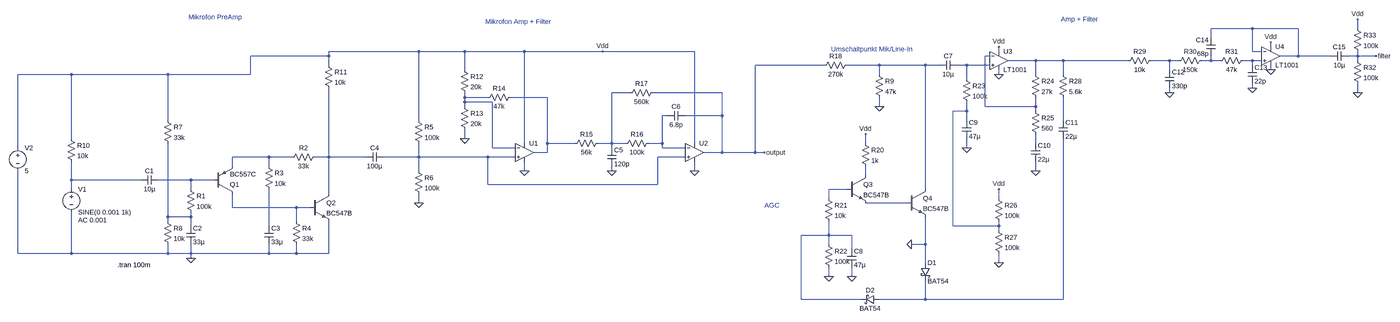
[diagram p0: schematic mikrofon input 2.asc, whole sheet]
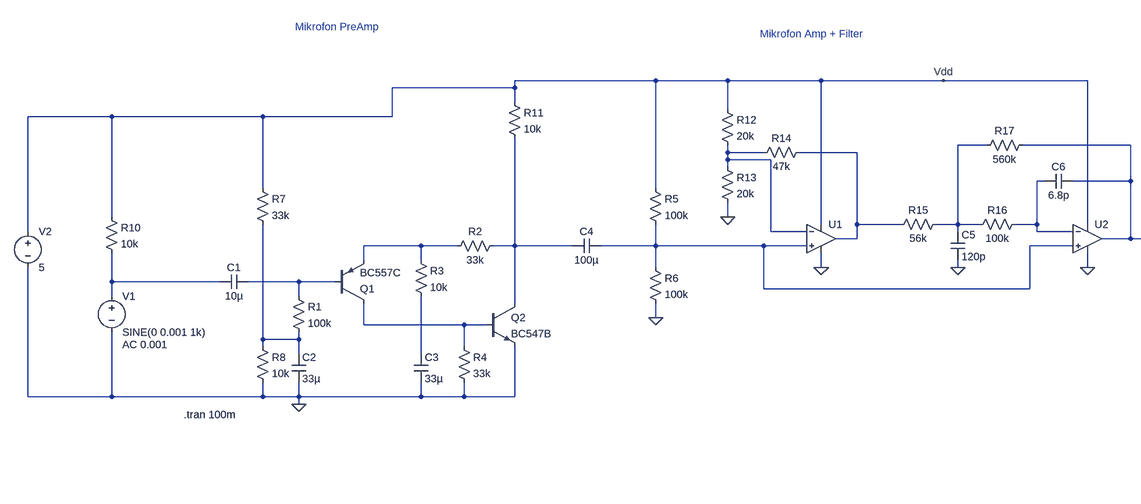
[diagram p1: schematic mikrofon input 2.asc, part, row 1 of 1, column 1 of 2]
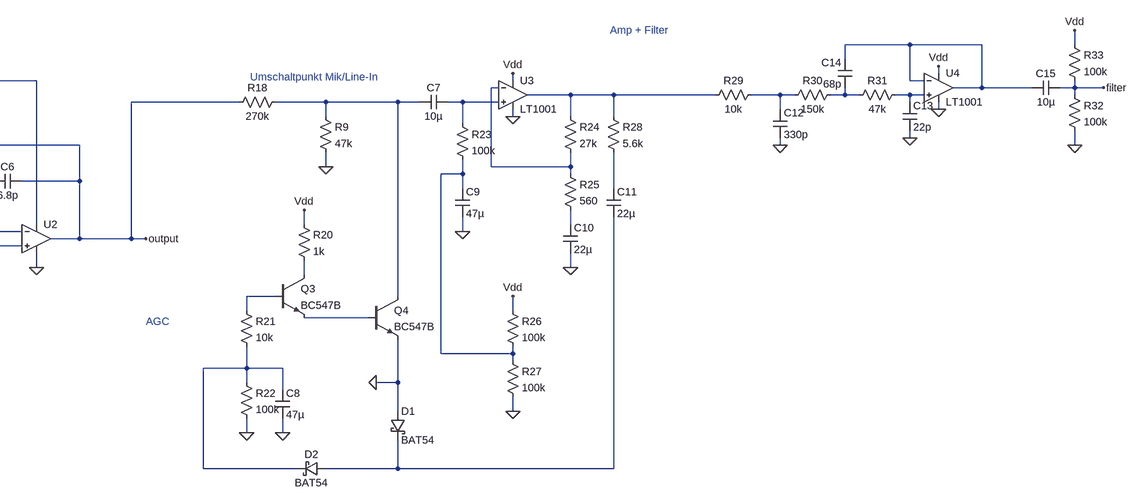
[diagram p2: schematic mikrofon input 2.asc, part, row 1 of 1, column 2 of 2]
mikrofon input 2.asc, the LTspice schematic file:
Version 4
SHEET 1 4684 680
WIRE 4144 -464 4000 -464
WIRE 4304 -464 4144 -464
WIRE 4544 -464 4544 -496
WIRE 4000 -432 4000 -464
WIRE 4208 -400 4208 -416
WIRE 1024 -384 704 -384
WIRE 1184 -384 1024 -384
WIRE 1392 -384 1184 -384
WIRE 1664 -384 1392 -384
WIRE 1984 -384 1664 -384
WIRE 3120 -384 3120 -400
WIRE 4144 -384 4144 -464
WIRE 4176 -384 4144 -384
WIRE 704 -368 704 -384
WIRE 704 -368 432 -368
WIRE 3088 -368 3072 -368
WIRE 4304 -368 4304 -464
WIRE 4304 -368 4240 -368
WIRE 4448 -368 4304 -368
WIRE 4544 -368 4544 -384
WIRE 4544 -368 4512 -368
WIRE 4608 -368 4544 -368
WIRE 3248 -352 3152 -352
WIRE 3344 -352 3248 -352
WIRE 3712 -352 3344 -352
WIRE 3856 -352 3792 -352
WIRE 3888 -352 3856 -352
WIRE 4000 -352 4000 -368
WIRE 4000 -352 3968 -352
WIRE 4032 -352 4000 -352
WIRE 4144 -352 4112 -352
WIRE 4176 -352 4144 -352
WIRE 4544 -352 4544 -368
WIRE 704 -336 704 -368
WIRE 2512 -336 2272 -336
WIRE 2704 -336 2592 -336
WIRE 2864 -336 2704 -336
WIRE 2912 -336 2864 -336
WIRE 3008 -336 2976 -336
WIRE 3088 -336 3008 -336
WIRE 4144 -336 4144 -352
WIRE 1184 -320 1184 -384
WIRE 3856 -320 3856 -352
WIRE 4208 -320 4208 -336
WIRE -192 -304 -400 -304
WIRE 144 -304 -192 -304
WIRE 432 -304 432 -368
WIRE 432 -304 144 -304
WIRE 2704 -304 2704 -336
WIRE 3120 -304 3120 -320
WIRE 3248 -304 3248 -352
WIRE 3344 -304 3344 -352
WIRE 3008 -288 3008 -336
WIRE 4144 -256 4144 -272
WIRE 1760 -240 1696 -240
WIRE 2080 -240 1840 -240
WIRE 3856 -240 3856 -256
WIRE 4544 -240 4544 -272
WIRE 1184 -224 1184 -240
WIRE 1264 -224 1184 -224
WIRE 1472 -224 1344 -224
WIRE 1184 -208 1184 -224
WIRE 1280 -208 1184 -208
WIRE 1184 -192 1184 -208
WIRE 2704 -192 2704 -224
WIRE 3072 -192 3072 -368
WIRE 3248 -192 3248 -224
WIRE 3248 -192 3072 -192
WIRE 3008 -176 3008 -208
WIRE 3008 -176 2960 -176
WIRE 3248 -176 3248 -192
WIRE 1888 -160 1872 -160
WIRE 2080 -160 2080 -240
WIRE 2080 -160 1952 -160
WIRE 144 -144 144 -304
WIRE 1024 -144 1024 -384
WIRE 3008 -144 3008 -176
WIRE 3344 -144 3344 -224
WIRE -192 -80 -192 -304
WIRE 1184 -80 1184 -112
WIRE 1392 -64 1392 -384
WIRE 1472 -64 1472 -224
WIRE 1568 -64 1472 -64
WIRE 1696 -64 1696 -240
WIRE 1696 -64 1648 -64
WIRE 1744 -64 1696 -64
WIRE 1872 -64 1872 -160
WIRE 1872 -64 1824 -64
WIRE 1984 -64 1984 -384
WIRE 2656 -64 2656 -96
WIRE 3248 -64 3248 -96
WIRE -400 -48 -400 -304
WIRE 1280 -48 1280 -208
WIRE 1360 -48 1280 -48
WIRE 1696 -48 1696 -64
WIRE 1872 -48 1872 -64
WIRE 1952 -48 1872 -48
WIRE 3008 -48 3008 -80
WIRE 1472 -32 1472 -64
WIRE 1472 -32 1424 -32
WIRE 2080 -32 2080 -160
WIRE 2080 -32 2016 -32
WIRE 2272 -32 2272 -336
WIRE 2272 -32 2080 -32
WIRE 2304 -32 2272 -32
WIRE 496 -16 368 -16
WIRE 576 -16 496 -16
WIRE 704 -16 704 -256
WIRE 704 -16 656 -16
WIRE 832 -16 704 -16
WIRE 1024 -16 1024 -64
WIRE 1024 -16 896 -16
WIRE 1264 -16 1024 -16
WIRE 1360 -16 1264 -16
WIRE 1952 -16 1856 -16
WIRE 368 16 368 -16
WIRE 496 16 496 -16
WIRE 1024 32 1024 -16
WIRE 1392 32 1392 0
WIRE 1696 32 1696 16
WIRE 1984 32 1984 0
WIRE 3248 32 3248 0
WIRE 2656 48 2656 16
WIRE -192 64 -192 0
WIRE 48 64 -192 64
WIRE 224 64 112 64
WIRE 304 64 224 64
WIRE 1264 80 1264 -16
WIRE 1856 80 1856 -16
WIRE 1856 80 1264 80
WIRE -192 96 -192 64
WIRE 224 96 224 64
WIRE 2592 96 2528 96
WIRE 2864 96 2864 -336
WIRE 704 112 704 -16
WIRE 2528 128 2528 96
WIRE 3120 128 3120 96
WIRE 1024 144 1024 112
WIRE 2800 144 2656 144
WIRE 368 160 368 112
WIRE 592 160 368 160
WIRE 640 160 592 160
WIRE 144 192 144 -64
WIRE 224 192 224 176
WIRE 224 192 144 192
WIRE 144 208 144 192
WIRE 592 208 592 160
WIRE 224 224 224 192
WIRE 496 224 496 96
WIRE 2960 224 2960 -176
WIRE 3120 224 3120 208
WIRE 3120 224 2960 224
WIRE 3120 240 3120 224
WIRE 2528 256 2528 208
WIRE 2528 256 2432 256
WIRE 2608 256 2528 256
WIRE 2528 288 2528 256
WIRE 2864 288 2864 192
WIRE 2864 288 2816 288
WIRE 2608 304 2608 256
WIRE -400 320 -400 32
WIRE -192 320 -192 176
WIRE -192 320 -400 320
WIRE 144 320 144 288
WIRE 144 320 -192 320
WIRE 224 320 224 288
WIRE 224 320 144 320
WIRE 496 320 496 288
WIRE 496 320 224 320
WIRE 592 320 592 288
WIRE 592 320 496 320
WIRE 704 320 704 208
WIRE 704 320 592 320
WIRE 224 336 224 320
WIRE 2864 352 2864 288
WIRE 3120 352 3120 320
WIRE 2528 400 2528 368
WIRE 2608 400 2608 368
WIRE 2432 480 2432 256
WIRE 2640 480 2432 480
WIRE 2864 480 2864 416
WIRE 2864 480 2704 480
WIRE 3344 480 3344 -80
WIRE 3344 480 2864 480
FLAG 224 336 0
FLAG 1392 32 0
FLAG 1984 32 0
FLAG 1024 144 0
FLAG 1184 -80 0
FLAG 1696 32 0
FLAG 2304 -32 output
FLAG 2656 -96 Vdd
FLAG 2528 400 0
FLAG 2608 400 0
FLAG 2816 288 0
FLAG 3120 -304 0
FLAG 3120 -400 Vdd
FLAG 3008 -48 0
FLAG 3248 32 0
FLAG 3120 96 Vdd
FLAG 3120 352 0
FLAG 3856 -240 0
FLAG 4208 -320 0
FLAG 4144 -256 0
FLAG 4208 -416 Vdd
FLAG 4544 -496 Vdd
FLAG 4544 -240 0
FLAG 4608 -368 filter
FLAG 1664 -384 Vdd
FLAG 2704 -192 0
SYMBOL voltage -192 80 R0
WINDOW 123 24 124 Left 2
WINDOW 39 0 0 Left 2
SYMATTR Value2 AC 0.001
SYMATTR InstName V1
SYMATTR Value SINE(0 0.001 1k)
SYMBOL cap 112 48 R90
WINDOW 0 0 32 VBottom 2
WINDOW 3 32 32 VTop 2
SYMATTR InstName C1
SYMATTR Value 10µ
SYMBOL res 208 80 R0
SYMATTR InstName R1
SYMATTR Value 100k
SYMBOL cap 208 224 R0
SYMATTR InstName C2
SYMATTR Value 33µ
SYMBOL pnp 304 112 M180
SYMATTR InstName Q1
SYMATTR Value BC557C
SYMBOL res 672 -32 R90
WINDOW 0 0 56 VBottom 2
WINDOW 3 32 56 VTop 2
SYMATTR InstName R2
SYMATTR Value 33k
SYMBOL cap 480 224 R0
SYMATTR InstName C3
SYMATTR Value 33µ
SYMBOL res 480 0 R0
SYMATTR InstName R3
SYMATTR Value 10k
SYMBOL npn 640 112 R0
SYMATTR InstName Q2
SYMATTR Value BC547B
SYMBOL res 576 192 R0
SYMATTR InstName R4
SYMATTR Value 33k
SYMBOL cap 896 -32 R90
WINDOW 0 0 32 VBottom 2
WINDOW 3 32 32 VTop 2
SYMATTR InstName C4
SYMATTR Value 100µ
SYMBOL res 128 192 R0
SYMATTR InstName R8
SYMATTR Value 10k
SYMBOL res 128 -160 R0
SYMATTR InstName R7
SYMATTR Value 33k
SYMBOL voltage -400 -64 R0
WINDOW 123 0 0 Left 2
WINDOW 39 0 0 Left 2
SYMATTR InstName V2
SYMATTR Value 5
SYMBOL res 688 -352 R0
SYMATTR InstName R11
SYMATTR Value 10k
SYMBOL res 1008 -160 R0
SYMATTR InstName R5
SYMATTR Value 100k
SYMBOL res 1008 16 R0
SYMATTR InstName R6
SYMATTR Value 100k
SYMBOL res 1168 -336 R0
SYMATTR InstName R12
SYMATTR Value 20k
SYMBOL res 1168 -208 R0
SYMATTR InstName R13
SYMATTR Value 20k
SYMBOL res 1360 -240 R90
WINDOW 0 0 56 VBottom 2
WINDOW 3 32 56 VTop 2
SYMATTR InstName R14
SYMATTR Value 47k
SYMBOL Opamps\\UniversalOpamp2 1392 -32 R0
SYMATTR InstName U1
SYMBOL Opamps\\UniversalOpamp2 1984 -32 R0
SYMATTR InstName U2
SYMBOL res 1664 -80 R90
WINDOW 0 0 56 VBottom 2
WINDOW 3 32 56 VTop 2
SYMATTR InstName R15
SYMATTR Value 56k
SYMBOL res 1840 -80 R90
WINDOW 0 0 56 VBottom 2
WINDOW 3 32 56 VTop 2
SYMATTR InstName R16
SYMATTR Value 100k
SYMBOL cap 1680 -48 R0
SYMATTR InstName C5
SYMATTR Value 120p
SYMBOL res 1856 -256 R90
WINDOW 0 0 56 VBottom 2
WINDOW 3 32 56 VTop 2
SYMATTR InstName R17
SYMATTR Value 560k
SYMBOL cap 1952 -176 R90
WINDOW 0 0 32 VBottom 2
WINDOW 3 32 32 VTop 2
SYMATTR InstName C6
SYMATTR Value 6.8p
SYMBOL res -208 -96 R0
SYMATTR InstName R10
SYMATTR Value 10k
SYMBOL cap 2976 -352 R90
WINDOW 0 0 32 VBottom 2
WINDOW 3 32 32 VTop 2
SYMATTR InstName C7
SYMATTR Value 10µ
SYMBOL res 2640 -80 R0
SYMATTR InstName R20
SYMATTR Value 1k
SYMBOL npn 2592 48 R0
SYMATTR InstName Q3
SYMATTR Value BC547B
SYMBOL npn 2800 96 R0
SYMATTR InstName Q4
SYMATTR Value BC547B
SYMBOL res 2512 112 R0
SYMATTR InstName R21
SYMATTR Value 10k
SYMBOL res 2512 272 R0
SYMATTR InstName R22
SYMATTR Value 100k
SYMBOL cap 2592 304 R0
SYMATTR InstName C8
SYMATTR Value 47µ
SYMBOL schottky 2848 352 R0
SYMATTR InstName D1
SYMATTR Value BAT54
SYMATTR Description Diode
SYMATTR Type diode
SYMBOL schottky 2704 464 R90
WINDOW 0 0 32 VBottom 2
WINDOW 3 32 32 VTop 2
SYMATTR InstName D2
SYMATTR Value BAT54
SYMATTR Description Diode
SYMATTR Type diode
SYMBOL Opamps\\LT1001 3120 -416 R0
SYMATTR InstName U3
SYMBOL res 2992 -304 R0
SYMATTR InstName R23
SYMATTR Value 100k
SYMBOL cap 2992 -144 R0
SYMATTR InstName C9
SYMATTR Value 47µ
SYMBOL res 3232 -320 R0
SYMATTR InstName R24
SYMATTR Value 27k
SYMBOL res 3232 -192 R0
SYMATTR InstName R25
SYMATTR Value 560
SYMBOL cap 3232 -64 R0
SYMATTR InstName C10
SYMATTR Value 22µ
SYMBOL res 3104 112 R0
SYMATTR InstName R26
SYMATTR Value 100k
SYMBOL res 3104 224 R0
SYMATTR InstName R27
SYMATTR Value 100k
SYMBOL res 3328 -320 R0
SYMATTR InstName R28
SYMATTR Value 5.6k
SYMBOL cap 3328 -144 R0
SYMATTR InstName C11
SYMATTR Value 22µ
SYMBOL res 3808 -368 R90
WINDOW 0 0 56 VBottom 2
WINDOW 3 32 56 VTop 2
SYMATTR InstName R29
SYMATTR Value 10k
SYMBOL res 3984 -368 R90
WINDOW 0 0 56 VBottom 2
WINDOW 3 32 56 VTop 2
SYMATTR InstName R30
SYMATTR Value 150k
SYMBOL res 4128 -368 R90
WINDOW 0 0 56 VBottom 2
WINDOW 3 32 56 VTop 2
SYMATTR InstName R31
SYMATTR Value 47k
SYMBOL cap 3840 -320 R0
SYMATTR InstName C12
SYMATTR Value 330p
SYMBOL Opamps\\LT1001 4208 -432 R0
SYMATTR InstName U4
SYMBOL cap 4128 -336 R0
SYMATTR InstName C13
SYMATTR Value 22p
SYMBOL cap 4016 -432 M0
SYMATTR InstName C14
SYMATTR Value 68p
SYMBOL cap 4512 -384 R90
WINDOW 0 0 32 VBottom 2
WINDOW 3 32 32 VTop 2
SYMATTR InstName C15
SYMATTR Value 10µ
SYMBOL res 4528 -368 R0
SYMATTR InstName R32
SYMATTR Value 100k
SYMBOL res 4528 -480 R0
SYMATTR InstName R33
SYMATTR Value 100k
SYMBOL res 2688 -320 R0
SYMATTR InstName R9
SYMATTR Value 47k
SYMBOL res 2608 -352 R90
WINDOW 0 0 56 VBottom 2
WINDOW 3 32 56 VTop 2
SYMATTR InstName R18
SYMATTR Value 270k
TEXT -32 360 Left 2 !.tran 100m
TEXT 216 -504 Left 2 ;Mikrofon PreAmp
TEXT 1256 -488 Left 2 ;Mikrofon Amp + Filter
TEXT 2536 -392 Left 2 ;Umschaltpunkt Mik/Line-In
TEXT 2304 152 Left 2 ;AGC
TEXT 3336 -496 Left 2 ;Amp + Filter

The netlist it stands for:
* mikrofon input 2.asc
V1 N020 0 SINE(0 0.001 1k) AC 0.001
C1 N021 N020 10µ
R1 N021 N025 100k
C2 N025 0 33µ
Q1 N024 N021 N016 0 BC557C
R2 N017 N016 33k
C3 N026 0 33µ
R3 N016 N026 10k
Q2 N017 N024 0 0 BC547B
R4 N024 0 33k
C4 N018 N017 100µ
R8 N025 0 10k
R7 Vdd N025 33k
V2 Vdd 0 5
R11 Vdd N017 10k
R5 Vdd N018 100k
R6 N018 0 100k
R12 Vdd N010 20k
R13 N010 0 20k
R14 N011 N010 47k
XU1 N018 N010 Vdd 0 N011 level.2 Avol=1Meg GBW=10Meg Slew=10Meg ilimit=25m rail=0 Vos=0 phimargin=45 en=0 enk=0 in=0 ink=0 Rin=500Meg  ; pins IN+ IN- V+ V- OUT
XU2 N018 N013 Vdd 0 output level.2 Avol=1Meg GBW=10Meg Slew=10Meg ilimit=25m rail=0 Vos=0 phimargin=45 en=0 enk=0 in=0 ink=0 Rin=500Meg  ; pins IN+ IN- V+ V- OUT
R15 N009 N011 56k
R16 N013 N009 100k
C5 N009 0 120p
R17 output N009 560k
C6 output N013 6.8p
R10 Vdd N020 10k
C7 N008 N007 10µ
R20 Vdd N019 1k
Q3 N019 N022 N023 0 BC547B
Q4 N007 N023 0 0 BC547B
R21 N022 N027 10k
R22 N027 0 100k
C8 N027 0 47µ
D1 0 N028 BAT54
D2 N028 N027 BAT54
XU3 N008 N002 Vdd 0 N003 LT1001  ; pins In+ In- V+ V- OUT
R23 N008 N012 100k
C9 N012 0 47µ
R24 N003 N002 27k
R25 N002 N015 560
C10 N015 0 22µ
R26 Vdd N012 100k
R27 N012 0 100k
R28 N003 N014 5.6k
C11 N014 N028 22µ
R29 N004 N003 10k
R30 N005 N004 150k
R31 N006 N005 47k
C12 N004 0 330p
XU4 N006 N001 Vdd 0 N001 LT1001  ; pins In+ In- V+ V- OUT
C13 N006 0 22p
C14 N001 N005 68p
C15 filter N001 10µ
R32 filter 0 100k
R33 Vdd filter 100k
R9 N007 0 47k
R18 N007 output 270k
.model D D
.lib standard.dio
.model NPN NPN
.model PNP PNP
.lib standard.bjt
.tran 100m
* Mikrofon PreAmp
* Mikrofon Amp + Filter
* Umschaltpunkt Mik/Line-In
* AGC
* Amp + Filter
.lib UniversalOpamps2.sub
.lib LTC.lib
.backanno
.end